# Altium schematic sheet 06_LED_OUTPUTS.SchDoc
size A3
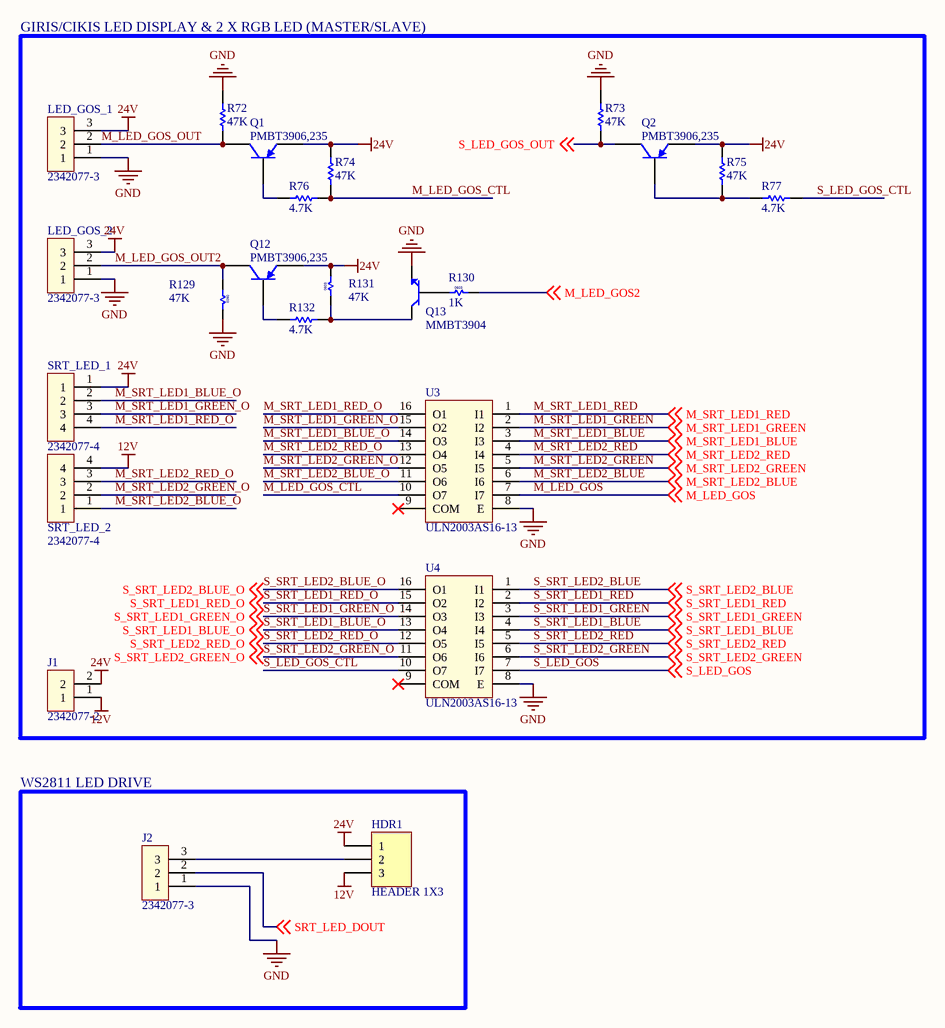
[diagram p0: 06_LED_OUTPUTS.SchDoc]

## Parts
HDR1  HEADER 1X3  [HDR1X3]
J1  2342077-2  [TERM BLOCK HDR 2POS 90DEG PITCH 3.81MM]
J2  2342077-3  [TERM BLOCK HDR 3POS 90DEG PITCH 3.81MM]
LED_GOS_1  2342077-3  [TERM BLOCK HDR 3POS 90DEG PITCH 3.81MM]
LED_GOS_2  2342077-3  [TERM BLOCK HDR 3POS 90DEG PITCH 3.81MM]
Q1  PMBT3906,235  [ONSC-SOT-23-3-318-08_V]
Q2  PMBT3906,235  [ONSC-SOT-23-3-318-08_V]
Q12  PMBT3906,235  [ONSC-SOT-23-3-318-08_V]
Q13  MMBT3904  [ONSC-SOT-23-3-318-08_V]
R72  47K  [603R]
R73  47K  [603R]
R74  47K  [603R]
R75  47K  [603R]
R76  4.7K  [603R]
R77  4.7K  [603R]
R129  47K  [603R]
R130  1K  [603R]
R131  47K  [603R]
R132  4.7K  [603R]
SRT_LED_1  2342077-4  [TERM BLOCK HDR 4POS 90DEG PITCH 3.81MM]
SRT_LED_2  2342077-4  [TERM BLOCK HDR 4POS 90DEG PITCH 3.81MM]
U3  ULN2003AS16-13  [SO16]
U4  ULN2003AS16-13  [SO16]

## Blocks framed on the sheet
GIRIS/CIKIS LED DISPLAY & 2 X RGB LED (MASTER/SLAVE): J1 LED_GOS_1 LED_GOS_2 Q1 Q2 Q12 Q13 R72-R77 R129-R132 SRT_LED_1 SRT_LED_2 U3 U4
WS2811 LED DRIVE: HDR1 J2

## Nets
12V: HDR1.3 J1.1 SRT_LED_2.4
24V: HDR1.1 J1.2 LED_GOS_1.3 LED_GOS_2.3 Q1.2(E) Q2.2(E) Q12.2(E) R74.2 R75.2 R131.2 SRT_LED_1.1
GND: J2.1 LED_GOS_1.1 LED_GOS_2.1 Q13.2(E) R72.1 R73.1 R129.2 U3.8(E) U4.8(E)
M_LED_GOS: U3.7(I7) ; off-sheet M_LED_GOS
M_LED_GOS2: R130.2 ; off-sheet M_LED_GOS2
M_LED_GOS_CTL: R74.1 R76.1 U3.10(O7)
M_LED_GOS_OUT: LED_GOS_1.2 Q1.3(C) R72.2
M_LED_GOS_OUT2: LED_GOS_2.2 Q12.3(C) R129.1
M_SRT_LED1_BLUE: U3.3(I3) ; off-sheet M_SRT_LED1_BLUE
M_SRT_LED1_BLUE_O: SRT_LED_1.2 U3.14(O3)
M_SRT_LED1_GREEN: U3.2(I2) ; off-sheet M_SRT_LED1_GREEN
M_SRT_LED1_GREEN_O: SRT_LED_1.3 U3.15(O2)
M_SRT_LED1_RED: U3.1(I1) ; off-sheet M_SRT_LED1_RED
M_SRT_LED1_RED_O: SRT_LED_1.4 U3.16(O1)
M_SRT_LED2_BLUE: U3.6(I6) ; off-sheet M_SRT_LED2_BLUE
M_SRT_LED2_BLUE_O: SRT_LED_2.1 U3.11(O6)
M_SRT_LED2_GREEN: U3.5(I5) ; off-sheet M_SRT_LED2_GREEN
M_SRT_LED2_GREEN_O: SRT_LED_2.2 U3.12(O5)
M_SRT_LED2_RED: U3.4(I4) ; off-sheet M_SRT_LED2_RED
M_SRT_LED2_RED_O: SRT_LED_2.3 U3.13(O4)
S_LED_GOS: U4.7(I7) ; off-sheet S_LED_GOS
S_LED_GOS_CTL: R77.1 U4.10(O7)
S_LED_GOS_OUT: Q2.3(C) R73.2 ; off-sheet S_LED_GOS_OUT
S_SRT_LED1_BLUE: U4.4(I4) ; off-sheet S_SRT_LED1_BLUE
S_SRT_LED1_BLUE_O: U4.13(O4) ; off-sheet S_SRT_LED1_BLUE_O
S_SRT_LED1_GREEN: U4.3(I3) ; off-sheet S_SRT_LED1_GREEN
S_SRT_LED1_GREEN_O: U4.14(O3) ; off-sheet S_SRT_LED1_GREEN_O
S_SRT_LED1_RED: U4.2(I2) ; off-sheet S_SRT_LED1_RED
S_SRT_LED1_RED_O: U4.15(O2) ; off-sheet S_SRT_LED1_RED_O
S_SRT_LED2_BLUE: U4.1(I1) ; off-sheet S_SRT_LED2_BLUE
S_SRT_LED2_BLUE_O: U4.16(O1) ; off-sheet S_SRT_LED2_BLUE_O
S_SRT_LED2_GREEN: U4.6(I6) ; off-sheet S_SRT_LED2_GREEN
S_SRT_LED2_GREEN_O: U4.11(O6) ; off-sheet S_SRT_LED2_GREEN_O
S_SRT_LED2_RED: U4.5(I5) ; off-sheet S_SRT_LED2_RED
S_SRT_LED2_RED_O: U4.12(O5) ; off-sheet S_SRT_LED2_RED_O
SRT_LED_DOUT: J2.2 ; off-sheet SRT_LED_DOUT
NetHDR1_2: HDR1.2 J2.3
NetQ1_1: Q1.1(B) R76.2
NetQ2_1: Q2.1(B) R75.1 R77.2
NetQ12_1: Q12.1(B) R132.2
NetQ13_1: Q13.1(B) R130.1
NetQ13_3: Q13.3(C) R131.1 R132.1

Not connected (* = marked no-connect by the designer): U3 9(COM)*; U4 9(COM)*

## Notes on the sheet
- (in symbol RES_1K_OHM_%5_0.1W_0603) 0603
- (in symbol RES_47K_OHM_%5_0.1W_0603) 0603

## Library data of the parts
HDR1 = HEADER 1X3: Header, 3-Pin; LatestRevisionDate: 17-Jul-2002; LatestRevisionNote: Re-released for DXP Platform.; Publisher: Altium Limited
J1 = TERM BLOCK HDR 2POS 90DEG 3.81MM: 2 Position Terminal Block Header, Male Pins, Shrouded (4 Side) 0.150" (3.81mm) 90°, Right Angle - Through Hole; Manufacturer: TE Connectivity AMP Connectors; Contact Tail Length: 0.075" (1.90mm); Digi-Key Part Number: A145321-ND; Value: 2342077-2; Pitch: 0.150" (3.81mm); Header Orientation: 90°, Right Angle; Insulation Height: 0.285" (7.25mm)
J2 LED_GOS_1 LED_GOS_2 = TERM BLOCK HDR 3POS 90DEG 3.81MM: 3 Position Terminal Block Header, Male Pins, Shrouded (4 Side) 0.150" (3.81mm) 90°, Right Angle - Through Hole; Manufacturer: TE Connectivity AMP Connectors; Contact Tail Length: 0.075" (1.90mm); Digi-Key Part Number: A145322-ND; Value: 2342077-3; Pitch: 0.150" (3.81mm); Header Orientation: 90°, Right Angle; Insulation Height: 0.285" (7.25mm)
Q1 Q2 Q12 = TRANS PNP 40V 200MA TO236AB PMBT3906_235: Bipolar (BJT) Transistor PNP 40 V 200 mA 250MHz 250 mW Surface Mount TO-236AB; DC Current Gain (hFE) (Min) @ Ic, Vce: 100 @ 10mA, 1V; Power - Max: 250 mW; Vce Saturation (Max) @ Ib, Ic: 400mV @ 5mA, 50mA; Voltage - Collector Emitter Breakdown (Max): 40 V; Current - Collector (Ic) (Max): 200 mA; Package / Case: TO-236-3, SC-59, SOT-23-3; Operating Temperature: 150°C (TJ); Transistor Type: PNP; Value: PMBT3906,235; Digi-Key Part Number: 1727-1885-1-ND
Q13 = NPN_BT3904: Bipolar (BJT) Transistor NPN 40V 200mA 300MHz 300mW Surface Mount SOT-23-3 (TO-236); Manufacturer: ON Semiconductor; Manufacturer Part Number: MMBT3904LT3G; MAX  Voltage / Current: 40V /200mA; DC Current Gain (hFE) (Min) @ Ic, Vce: 100 @ 10mA, 1V; Vce Saturation (Max) @ Ib, Ic: 300mV @ 5mA, 50mA; value: MMBT3904; Digi-Key Part Number: MMBT3904LT3GOSTR-ND; Package / Case: TO-236-3, SC-59, SOT-23-3; Power - Max: 300mW; Frequency - Transition: 300MHz; Transistor Type: NPN; Current - Collector (Ic) (Max): 200mA; Voltage - Collector Emitter Breakdown (Max): 40V; Operating Temperature: -55°C ~ 150°C (TJ); Supplier Device Package: SOT-23-3 (TO-236)
R72-R75 = RES SMD 47K OHM 1% 1/10W 0603: 47 kOhms ±1% 0.1W, 1/10W Chip Resistor 0603 (1608 Metric)  Thick Film; Manufacturer: Yageo; Manufacturer Part Number: RC0603FR-0747KL; Temperature Coefficient: ±100ppm/°C; Value: 47K; Digi-Key Part Number: 311-47.0KHRCT-ND; Tolerance: ±1%; Power (Watts): 0.1W, 1/10W; Composition: Thick Film; Operating Temperature: -55°C ~ 155°C; Package / Case: 0603 (1608 Metric); Size / Dimension: 0.063" L x 0.032" W (1.60mm x 0.80mm); Height - Seated (Max): 0.022" (0.55mm)
R76 R77 R132 = RES_4.7K_OHM_%5_0.1W_0603: 4.7 kOhms ±5% 0.1W, 1/10W Chip Resistor 0603 (1608 Metric) Moisture Resistant Thick Film; Manufacturer: Yageo; Manufacturer Part Number: RC0603JR-074K7L; Temperature Coefficient: ±100ppm/°C; Value: 4.7K; Digi-Key Part Number: 311-4.7KGRTR-ND; Tolerance: ±5%; Power (Watts): 0.1W, 1/10W; Composition: Thick Film; Operating Temperature: -55°C ~ 155°C; Package / Case: 0603 (1608 Metric); Size / Dimension: 0.063" L x 0.032" W (1.60mm x 0.80mm); Height - Seated (Max): 0.022" (0.55mm); Features: Moisture Resistant
R129 R131 = RES_47K_OHM_%5_0.1W_0603: 47 kOhms ±5% 0.1W, 1/10W Chip Resistor 0603 (1608 Metric) Moisture Resistant Thick Film; Manufacturer: Yageo; Manufacturer Part Number: RC0603JR-0747KL; Temperature Coefficient: ±100ppm/°C; Value: 47K; Digi-Key Part Number: 311-47KGRTR-ND; Tolerance: ±5%; Power (Watts): 0.1W, 1/10W; Composition: Thick Film; Operating Temperature: -55°C ~ 155°C; Package / Case: 0603 (1608 Metric); Size / Dimension: 0.063" L x 0.032" W (1.60mm x 0.80mm); Height - Seated (Max): 0.022" (0.55mm); Features: Moisture Resistant
R130 = RES_1K_OHM_%5_0.1W_0603: 1 kOhms ±5% 0.1W, 1/10W Chip Resistor 0603 (1608 Metric) Moisture Resistant Thick Film; Manufacturer: Yageo; Manufacturer Part Number: RC0603JR-071KL; Temperature Coefficient: ±100ppm/°C; Value: 1K; Digi-Key Part Number: 311-1.0KGRTR-ND; Tolerance: ±5%; Power (Watts): 0.1W, 1/10W; Composition: Thick Film; Operating Temperature: -55°C ~ 155°C; Package / Case: 0603 (1608 Metric); Size / Dimension: 0.063" L x 0.032" W (1.60mm x 0.80mm); Height - Seated (Max): 0.022" (0.55mm); Features: Moisture Resistant
SRT_LED_1 SRT_LED_2 = TERM BLOCK HDR 4POS 90DEG 3.81MM: 4 Position Terminal Block Header, Male Pins, Shrouded (4 Side) 0.150" (3.81mm) 90°, Right Angle - Through Hole; Manufacturer: TE Connectivity AMP Connectors; Contact Tail Length: 0.075" (1.90mm); Digi-Key Part Number: A145323-ND; Value: 2342077-4; Pitch: 0.150" (3.81mm); Header Orientation: 90°, Right Angle; Insulation Height: 0.285" (7.25mm)
U3 U4 = IC PWR RELAY 7NPN 1:1 16SO ULN2003AS16-13: Bipolar (BJT) Transistor Array 7 NPN Darlington 50V 500mA - - Surface Mount 16-SO; Manufacturer: Diodes Incorporated; Current - Supply: 285µA; Vce Saturation (Max) @ Ib, Ic: 1.6V @ 500µA, 350mA; Digi-Key Part Number: ULN2003AS16-13DICT-ND; Value: ULN2003AS16-13; Operating Temperature: -40°C ~ 105°C (TA); Transistor Type: 7 NPN Darlington; Current - Collector (Ic) (Max): 500mA; Package / Case: 16-SOIC (0.154", 3.90mm Width); Voltage - Collector Emitter Breakdown (Max): 50V